# EAGLE design power-wing (EAGLE 7.3.0)
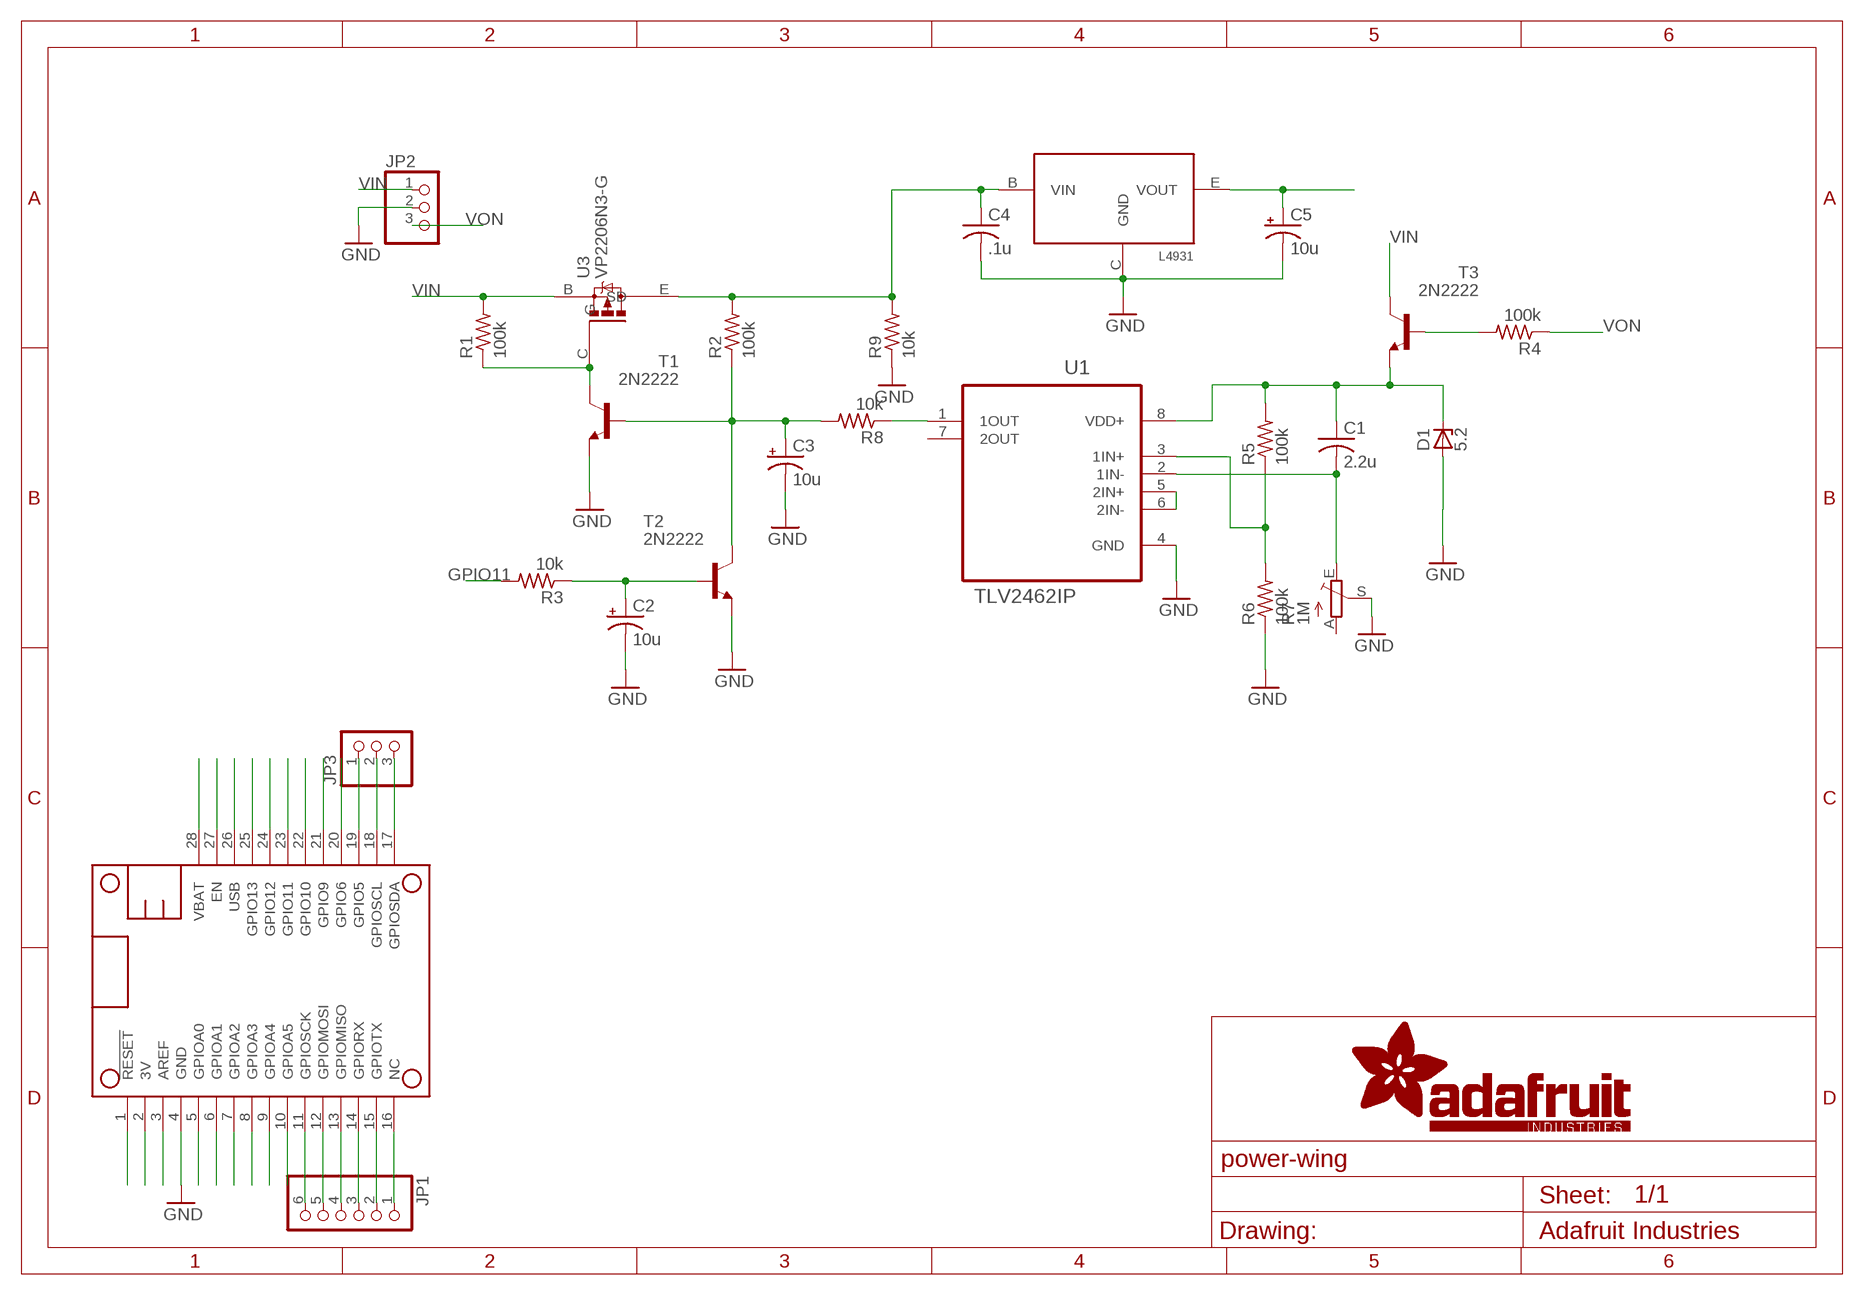
[diagram p0: schematic, sheet 1]

## Parts
C1  2.2u  C-US025-024X044  [C025-024X044]
C2  10u  CPOL-USE1.8-4  [E1,8-4]
C3  10u  CPOL-USE1.8-4  [E1,8-4]
C4  .1u  C-US025-024X044  [C025-024X044]
C5  10u  CPOL-USE1.8-4  [E1,8-4]
D1  5.2  ZENER-DIODEDO34-7  [DO34Z7]
JP1  PINHD-1X6  [1X06]
JP2  PINHD-1X3  [1X03]
JP3  PINHD-1X3  [1X03]
MS1  FEATHERWING  [FEATHERWING]
R1  100k  R-US_0204/5  [0204/5]
R2  100k  R-US_0204/5  [0204/5]
R3  10k  R-US_0204/5  [0204/5]
R4  100k  R-US_0204/5  [0204/5]
R5  100k  R-US_0204/5  [0204/5]
R6  100k  R-US_0204/5  [0204/5]
R7  1M  TRIM_EU-PTSPIN  [PT-SPIN]
R8  10k  R-US_0204/5  [0204/5]
R9  10k  R-US_0204/5  [0204/5]
T1  2N2222  [TO92-EBC-OVAL]
T2  2N2222  [TO92-EBC-OVAL]
T3  2N2222  [TO92-EBC-OVAL]
U1  TLV2462IP  [DIP254P762X508-8]
U2  L4931  [TO92-BCE]
U3  VP2206N3-G  [TO92-BCE]

## Nets
3V: C5.+ MS1.2(3V) U2.E(VOUT)
AREF: MS1.3(AREF)
GND: C2.- C3.- C4.2 C5.- JP2.2 MS1.4(GND) R6.1 R7.S R9.1 T1.E T2.E U1.4(GND) U2.C(GND)
GPIO11: MS1.23(GPIO11) R3.2
GPIO12: MS1.24(GPIO12)
N$1: MS1.27(EN)
N$2: JP1.1 MS1.16(NC)
N$3: MS1.25(GPIO13)
N$4: JP1.2 MS1.15(GPIOTX)
N$6: JP1.3 MS1.14(GPIORX)
N$7: JP1.4 MS1.13(GPIOMISO)
N$8: JP1.5 MS1.12(GPIOMOSI)
N$9: JP1.6 MS1.11(GPIOSCK)
N$10: MS1.10(GPIOA5)
N$11: MS1.9(GPIOA4)
N$12: MS1.8(GPIOA3)
N$13: MS1.7(GPIOA2)
N$14: MS1.6(GPIOA1)
N$15: MS1.5(GPIOA0)
N$16: R1.1 T1.C U3.C(G)
N$17: C3.+ R2.1 R8.2 T1.B T2.C
N$18: MS1.1(!RESET)
N$20: MS1.22(GPIO10)
N$21: MS1.21(GPIO9)
N$22: MS1.20(GPIO6)
N$23: JP3.1 MS1.19(GPIO5)
N$24: JP3.2 MS1.18(GPIOSCL)
N$25: JP3.3 MS1.17(GPIOSDA)
N$26: D1.A
N$27: C2.+ R3.1 T2.B
N$28: R5.1 R6.2 U1.3(1IN+)
N$29: C1.1 D1.C R5.2 T3.E U1.8(VDD+)
N$34: C1.2 R7.E U1.2(1IN-)
N$35: R4.2 T3.B
N$36: U1.5(2IN+) U1.6(2IN-)
N$37: R8.1 U1.1(1OUT)
USB: MS1.26(USB)
VBAT: MS1.28(VBAT)
VIN: JP2.1 R1.2 T3.C U3.B(S)
VON: JP2.3 R4.1
VOUT: C4.1 R2.2 R9.2 U2.B(VIN) U3.E(D)
Unconnected: R7.A U1.7(2OUT)

## Library data of the parts
C1 C4 = adafruit:C-US: CAPACITOR, American symbol
C2 C3 C5 = adafruit:CPOL-US: POLARIZED CAPACITOR, American symbol
D1 = diode:ZENER-DIODE: Z-Diode
JP1 = adafruit:PINHD-1X6: PIN HEADER
JP2 JP3 = adafruit:PINHD-1X3: PIN HEADER
MS1 = microbuilder:FEATHERWING
R1-R6 R8 R9 = adafruit:R-US_: RESISTOR, American symbol
R7 = pot:TRIM_EU-: POTENTIOMETER
T1-T3 = adafruit:2N2222: NPN TRANSISTOR Big oval pads
U1 = Texas Instruments_By_element14_Batch_1:TLV2462IP: OPERATIONAL AMPLIFIER; MPN: TLV2462IP; OC_FARNELL: -; OC_NEWARK: 76C8207; PACKAGE: PDIP; SUPPLIER: Texas Instruments
U2 = dm_parts:L4931: L4931 250mA 3.3V regulator
U3 = dm_parts:VP2206N3-G: P channel mosfet

## Board
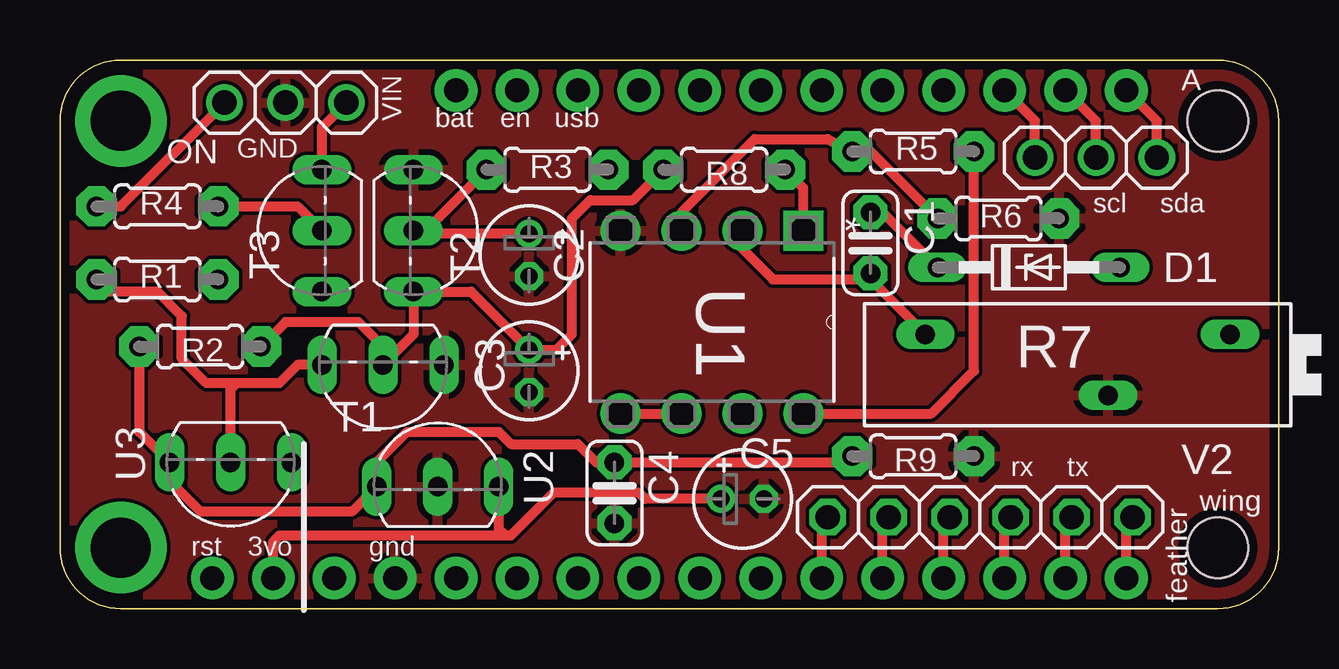
[diagram p1: board, top side]
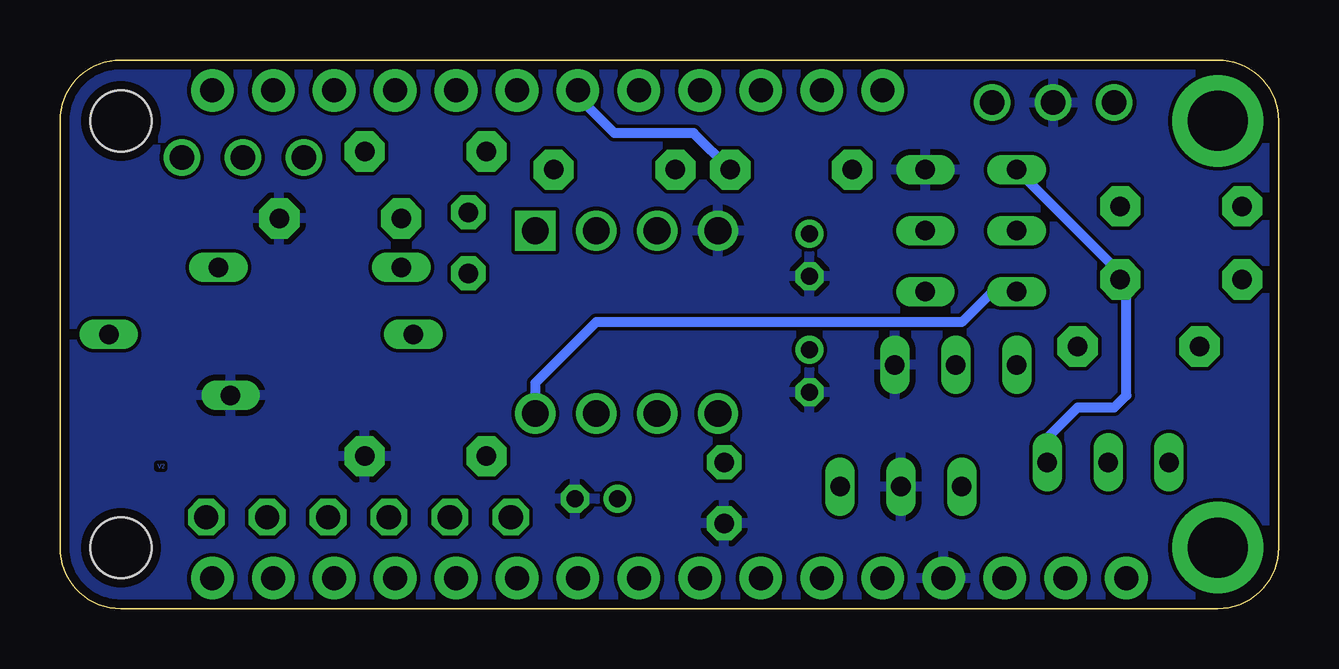
[diagram p2: board, bottom side, seen from below]

Size 50.8 x 22.86 mm. Coordinates in mm from the lower left corner, seen from the top.
Outline: 2.54,22.86 48.26,22.86 arc-90 50.8,20.32 50.8,2.54 arc-90 48.26,0 2.54,0 arc-90 0,2.54 0,20.32 arc-90 2.54,22.86
Copper layers (1*16): Top 0.0356mm / dielectric 1.5011mm / Bottom 0.0356mm
Design rules "LaenPCBOrder *": minimum track width 6mil, minimum drill 13mil, track to track 6mil, track to pad 6mil, pad to pad 6mil, via to via 6mil, smd to smd 6mil, copper to edge 15mil, drill to drill 6mil, minimum pad ring 7mil, minimum via ring 7mil, stop-mask expansion 0mil, vias tented up to drill 0mil, thermal gap 10mil

### Footprints (pad centres in the part's own frame; a part is rotated, then mirrored left to right if it is on the bottom)
C025-024X044 = drill 0.813 pad 1.422 octagon: 1 -1.27,0; 2 1.27,0
E1,8-4 = drill 0.711 pad 1.168: + -0.889,0 | drill 0.711 pad 1.168 octagon: - 0.889,0
DO34Z7 = drill 0.813 long: A 3.81,0; C -3.81,0
1X06 = drill 1.016 octagon: 1 -6.35,0; 2 -3.81,0; 3 -1.27,0; 4 1.27,0; 5 3.81,0; 6 6.35,0
1X03 = drill 1.016: 1 -2.54,0; 2 0,0; 3 2.54,0
FEATHERWING = drill 1 pad 1.778: 1 6.35,1.27; 2 8.89,1.27; 3 11.43,1.27; 4 13.97,1.27; 5 16.51,1.27; 6 19.05,1.27; 7 21.59,1.27; 8 24.13,1.27; 9 26.67,1.27; 10 29.21,1.27; 11 31.75,1.27; 12 34.29,1.27; 13 36.83,1.27; 14 39.37,1.27; 15 41.91,1.27; 16 44.45,1.27; 17 44.45,21.59; 18 41.91,21.59; 19 39.37,21.59; 20 36.83,21.59; 21 34.29,21.59; 22 31.75,21.59; 23 29.21,21.59; 24 26.67,21.59; 25 24.13,21.59; 26 21.59,21.59; 27 19.05,21.59; 28 16.51,21.59 | drill 2.5 pad 3.81: P$1 2.54,20.32; P$2 2.54,2.54 | hole 2.54: 48.26,20.32; 48.26,2.54
0204/5 = drill 0.813 pad 1.676 octagon: 1 -2.54,0; 2 2.54,0
PT-SPIN = drill 0.813 long: A -6.35,-1.27; E 6.35,-1.27; S -1.27,1.27
TO92-EBC-OVAL = drill 0.813 long: B 0,-1.27; C 2.54,-1.27; E -2.54,-1.27
DIP254P762X508-8 = drill 1.118 square: 1 -7.62,7.62 | drill 1.118: 2 -7.62,5.08; 3 -7.62,2.54; 4 -7.62,0; 5 0,0; 6 0,2.54; 7 0,5.08; 8 0,7.62
TO92-BCE = drill 0.813 long: B -2.54,0; C 0,0; E 2.54,0

### Placement (x,y rotation side)
C1  33.78,15.24 270 top
C2  19.56,14.73 270 top
C3  19.56,9.91 270 top
C4  23.11,4.83 270 top
C5  28.45,4.57 0 top
D1  40.39,14.22 0 top
JP1  38.35,3.81 180 top
JP2  9.4,21.08 180 top
JP3  43.18,18.8 0 top
MS1  0,0 0 top
R1  4.06,13.72 0 top
R2  5.84,10.92 180 top
R3  20.32,18.29 0 top
R4  4.06,16.76 0 top
R5  35.56,19.05 0 top
R6  39.12,16.26 180 top
R7  42.42,10.16 180 top
R8  27.69,18.29 180 top
R9  35.56,6.35 180 top
T1  13.46,8.89 180 top
T2  16,15.75 270 top
T3  9.65,15.75 90 top
U1  23.37,8.13 270 top
U2  15.75,5.08 0 top
U3  7.11,6.1 180 top

### Tracks (layer width: path | path; a pad name or v marks a point on that pad's centre or on a via)
3V
  Top 0.406: MS1.2 8.89,2.79 9.14,3.05 18.54,3.05 | 18.54,3.05 18.8,3.05 20.57,4.83 24.13,4.83 24.38,4.57 C5.+ | U2.E 18.29,3.3 18.54,3.05
GND
  pour Bottom: 58.42,-2.54 -5.08,-2.54 -5.08,27.94 58.42,27.94
  pour Top: -5.08,-5.08 60.96,-5.08 60.96,27.94 -5.08,27.94
GPIO11
  Bottom 0.406: R3.2 24.38,19.81 27.69,19.81 29.21,21.34 MS1.23
N$2
  Top 0.406: MS1.16 44.45,3.56 JP1.1
N$4
  Top 0.406: MS1.15 41.91,3.56 JP1.2
N$6
  Top 0.406: MS1.14 39.37,3.56 JP1.3
N$7
  Top 0.406: MS1.13 36.83,3.56 JP1.4
N$8
  Top 0.406: MS1.12 34.29,3.56 JP1.5
N$9
  Top 0.406: MS1.11 31.75,3.56 JP1.6
N$16
  Top 0.406: R1.1 1.52,13.21 4.06,13.21 5.08,12.19 5.08,10.41 6.1,9.4 7.37,9.4 | T1.C 9.91,10.16 9.14,9.4 7.37,9.4 | 7.37,9.4 7.11,9.14 U3.C
N$17
  Top 0.406: R8.2 23.88,17.02 22.1,17.02 21.34,16.26 21.34,11.43 20.7,10.79 C3.+ 17.14,13.21 T2.C 14.73,11.43 T1.B 13.46,10.92 12.45,11.94 9.4,11.94 R2.1
N$23
  Top 0.406: JP3.1 40.64,20.32 MS1.19
N$24
  Top 0.406: JP3.2 43.18,20.32 MS1.18
N$25
  Top 0.406: JP3.3 45.72,20.32 MS1.17
N$27
  Top 0.406: R3.1 15.24,15.75 T2.B 14.86,15.62 C2.+
N$28
  Top 0.406: U1.3 25.91,16.51 28.96,19.56 32,19.56 R5.1 33.78,19.05 R6.2
N$29
  Top 0.406: 38.1,13.97 38.1,9.91 36.32,8.13 U1.8 | 38.1,13.97 R5.2 | 38.1,13.97 37.85,14.22 D1.C 34.29,16.51 C1.1
  Bottom 0.406: T3.E 11.94,13.21 13.21,11.94 28.45,11.94 30.99,9.4 U1.8
N$34
  Top 0.406: U1.2 28.45,14.99 29.72,13.72 33.53,13.72 C1.2 33.78,13.72 R7.E
N$35
  Top 0.406: R4.2 9.91,16.76 T3.B
N$36
  Top 0.406: U1.5 U1.6
N$37
  Top 0.406: U1.1 30.99,17.53 R8.1
VIN
  Top 0.406: T3.C 10.92,20.07 JP2.1
  Bottom 0.406: T3.C 6.6,13.97 R1.2 6.35,13.46 6.35,8.89 6.86,8.38 8.38,8.38 9.65,7.11 U3.B
VON
  Top 0.406: R4.1 2.54,16.76 JP2.3
VOUT
  Top 0.406: R9.2 32.77,6.1 C4.1 22.35,6.1 21.59,6.86 18.8,6.86 18.29,7.37 14.48,7.37 13.21,6.1 U2.B 12.19,4.06 5.84,4.06 4.57,5.33 U3.E 3.3,7.37 R2.2

### Text on the board
Bottom: V2
tPlace: A | ON | VIN | bat | en | usb | GND | scl | sda | rx | tx | wing | rst | 3vo | gnd | feather
tNames: V2